# Altium project ElectronicsBox_v2.PrjPcb
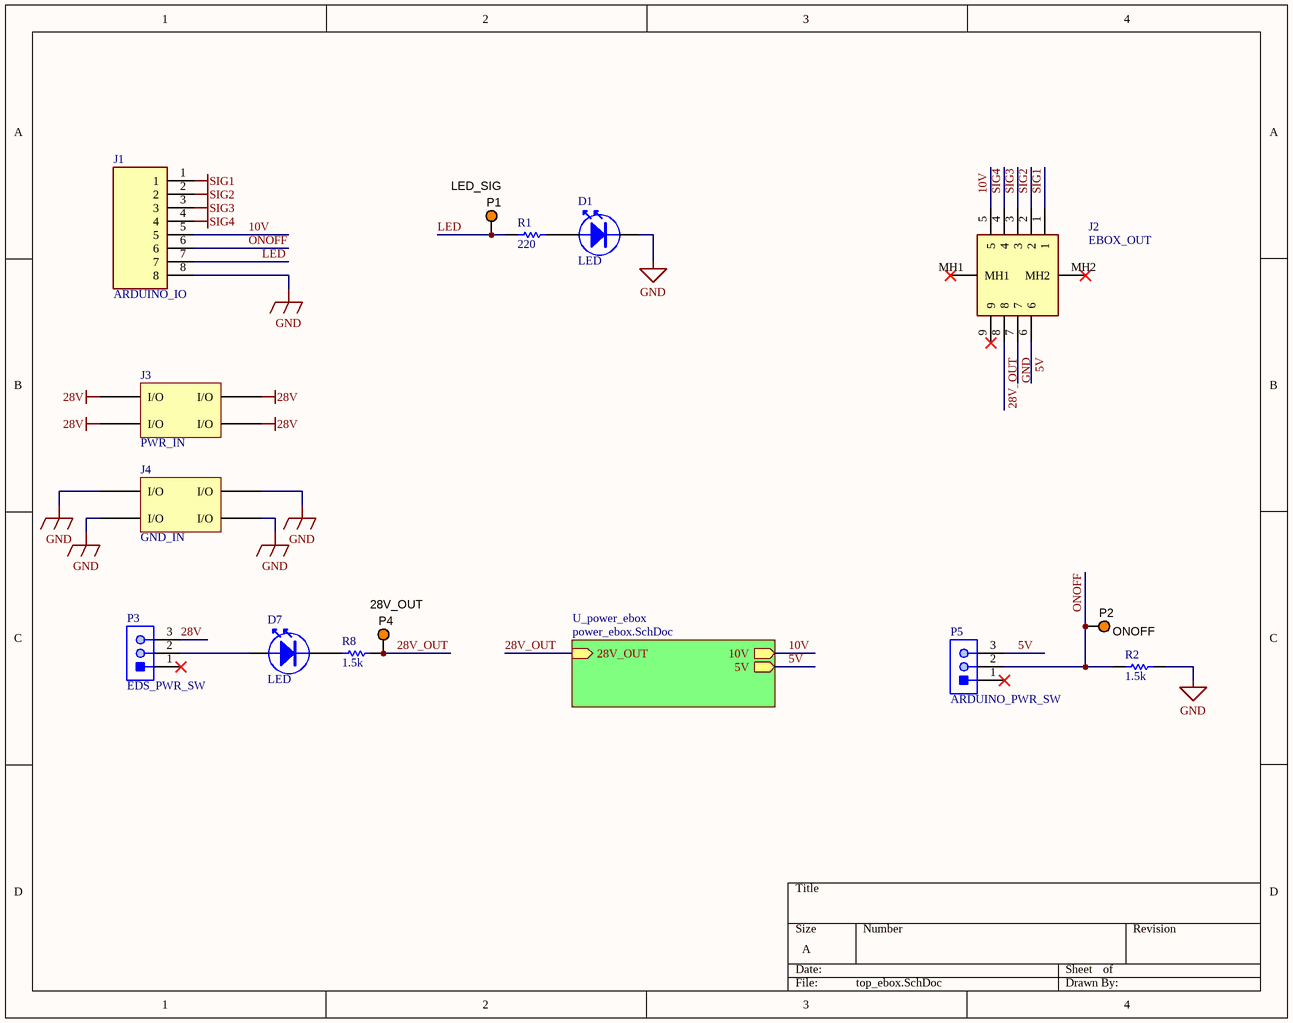
[diagram p0: top_ebox.SchDoc]
2 sheets, 35 parts. Net scope: hierarchical (ports join the sheet entries above them; power ports are global).
Board file: ebox_board.PcbDoc
Sheets:
  top_ebox.SchDoc
    U_power_ebox = power_ebox.SchDoc

## Sheet top_ebox.SchDoc
size A; SheetNumber: 1; SheetTotal: 2

### Parts
D1  LED  [LED 5V Arduino Thru Hole]
D7  LED  [LED 12V Thru Hole]
J1  ARDUINO_IO  [1x8 Molex Header - Female]
J2  EBOX_OUT  [9-Pin D-Sub]
J3  PWR_IN  [Banana Jack]
J4  GND_IN  [Banana Jack]
P1  LED_SIG  [KSTN-5003]
P2  ONOFF  [KSTN-5003]
P3  EDS_PWR_SW  [3x1 KK Molex]
P4  28V_OUT  [KSTN-5003]
P5  ARDUINO_PWR_SW  [3x1 KK Molex]
R1  220  [General Resistor]
R2  1.5k  [General Resistor]
R8  1.5k  [General Resistor]

### Sub-sheets
U_power_ebox = power_ebox.SchDoc: 10V (out), 5V (out), 28V_OUT (in)

### Nets
28V: J3.1(I/O) J3.2(I/O) J3.3(I/O) J3.4(I/O) P3.3
GND: D1.2 J1.8 J2.7 J4.1(I/O) J4.2(I/O) J4.3(I/O) J4.4(I/O) R2.1
SIG1: J1.1 J2.1
SIG2: J1.2 J2.2
SIG3: J1.3 J2.3
SIG4: J1.4 J2.4
5V: J2.6 P5.3 ; sheet U_power_ebox/5V
10V: J1.5 J2.5 ; sheet U_power_ebox/10V
28V_OUT: J2.8 P4.1 R8.1 ; sheet U_power_ebox/28V_OUT
LED: J1.7 P1.1 R1.2
ONOFF: J1.6 P2.1 P5.2 R2.2
NetD1_1: D1.1 R1.1
NetD7_1: D7.1 P3.2
NetD7_2: D7.2 R8.2

Not connected (* = marked no-connect by the designer): J2 9* MH1* MH2*; P3 1*; P5 1*

### Library data of the parts
J1 = 207843-0008: KK Molex 1x8 Header; Datasheet Link: https://www.molex.com/pdm_docs/sd/2078430008_sd.pdf; Height: 6.95mm; Manufacturer_Name: Molex; Manufacturer_Part_Number: 207843-0008; Mouser Part Number: 538-207843-0008; Mouser Price/Stock: https://www.mouser.co.uk/ProductDetail/Molex/207843-0008?qs=XeJtXLiO41QJV3n1oae5pg%3D%3D
J2 = 2311765-1: Connector; Manufacturer_Name: TE Connectivity; Datasheet Link: https://componentsearchengine.com//2311765-1.pdf; Height: 12.8mm; Mouser2 Part Number: 571-2311765-1; Mouser2 Price/Stock: https://www.mouser.com/Search/Refine.aspx?Keyword=571-2311765-1; Manufacturer_Part_Number: 2311765-1
J3 J4 = Banana Jack: Female
P1 P2 P4 = CMP-002-00037-2: Test Point, Orange, Height 4.6 mm, Tail Length 3 mm, 1-Pin THD, RoHS; Manufacturer: Keystone; Colour: Orange; Packaging: Bulk; Package Description: 1-Pin Through Hole Device, Dia 2.54 mm; Pins: 1; Package Reference: 5003; Datasheet Version: Jun-15; Case/Package: 5003; Mounting Technology: TH; Connector Type: TestPoint; Diameter: 2.54mm; Contact Material: Bronze; Datasheet URL: http://keyelco.com/userAssets/file/M65p56.pdf; Manufacturer URL: http://www.keyelco.com/; Package Quantity: 10; Contact Plating: Tin; RoHS Compliant: True
P3 P5 = KK 254 1x3 male header: 22112032
R1 R2 R8 = Resistor

## Sheet power_ebox.SchDoc
size A; SheetNumber: 2; SheetTotal: 2
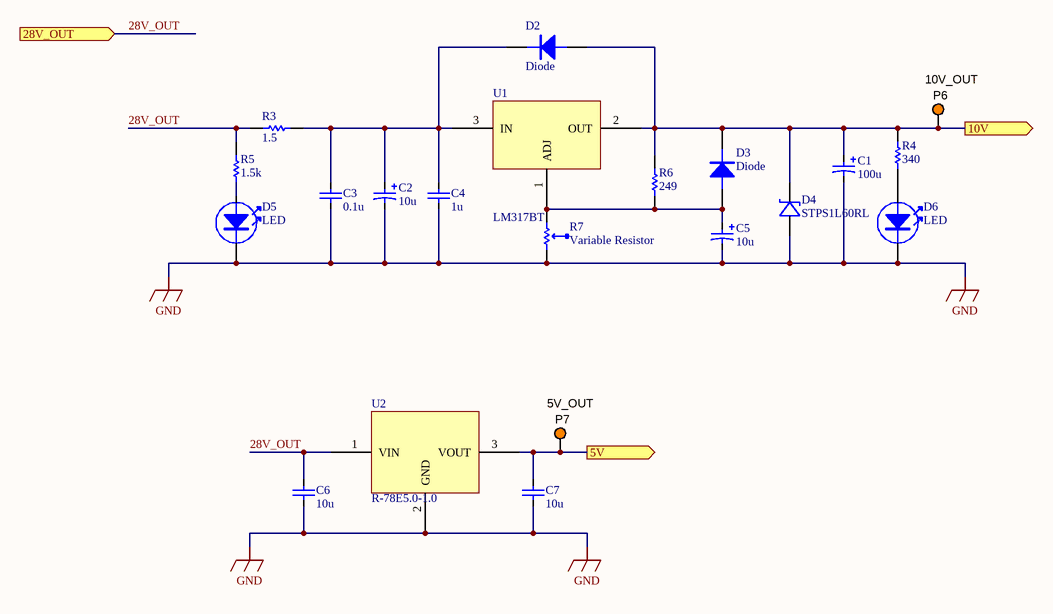
[diagram p1: power_ebox.SchDoc]

### Parts
C1  100u  [100uF Tantalum]
C2  10u  [10uF Tantalum]
C3  0.1u  [0.1uF Cer SMD]
C4  1u  [1uF]
C5  10u  [10uF Electrolytic]
C6  10u  [10uF Cer SMD]
C7  10u  [10uF Cer SMD]
D2  Diode  [Protective Diode]
D3  Diode  [Protective Diode]
D4  STPS1L60RL  [Schottky]
D5  LED  [LED 12V Thru Hole]
D6  LED  [LED 5V Thru Hole]
P6  10V_OUT  [KSTN-5003]
P7  5V_OUT  [KSTN-5003]
R3  1.5  [1.5 Ohm]
R4  340  [340 Ohm]
R5  1.5k  [General Resistor]
R6  249  [249 Ohm]
R7  Variable Resistor  [General Resistor]
U1  LM317BT  [LM317(B)T]
U2  R-78E5.0-1.0  [Step-Down Converter]

### Ports
5V (out), 10V (out), 28V_OUT (in)

### Nets
GND: C1.2 C2.2 C3.1 C4.1 C5.2 C6.1 C7.1 D4.1 D5.2 D6.2 R7.2 U2.2(GND)
5V: C7.2 P7.1 U2.3(VOUT) ; port 5V
10V: C1.1 D2.1 D3.2 D4.2 P6.1 R4.1 R6.1 U1.2(OUT) ; port 10V
28V_OUT: C6.2 R3.2 R5.1 U2.1(VIN) ; port 28V_OUT
NetC2_1: C2.1 C3.2 C4.2 D2.2 R3.1 U1.3(IN)
NetC5_1: C5.1 D3.1 R6.2 R7.1 U1.1(ADJ)
NetD5_1: D5.1 R5.2
NetD6_1: D6.1 R4.2

### Library data of the parts
C1 C2 = Capacitor - Polarized
C3 C4 C6 C7 = Capacitor - Ceramic
C5 = Capacitor - Polarized: Electrolytic
D4 = Schottky: Mfr_Name: STMicroelectronics; Type: DEV; Copyright: Copyright (C) 2021 Ultra Librarian. All rights reserved.; Manufacturer_Part_Number: STPS1L60RL; Digi-Key_Part_Number_1: 497-16205-2-ND; Digi-Key_Part_Number_2: 497-16205-1-ND; RefDes: RefDes
P6 P7 = CMP-002-00037-2: as P1 on sheet top_ebox; Colour: Orange; Packaging: Bulk; Package Description: 1-Pin Through Hole Device, Dia 2.54 mm; Pins: 1; Package Reference: 5003; Datasheet Version: Jun-15; Case/Package: 5003; Mounting Technology: TH; Connector Type: TestPoint; Diameter: 2.54mm; Contact Material: Bronze; Datasheet URL: http://keyelco.com/userAssets/file/M65p56.pdf; Manufacturer URL: http://www.keyelco.com/; Package Quantity: 10; Contact Plating: Tin; RoHS Compliant: True
R3-R6 = Resistor
U1 = Linear Regulator
U2 = Step-down Converter

## Nets that join several sheets
GND: top_ebox (8 pins), power_ebox (12 pins)
5V: top_ebox (J2.6 P5.3), power_ebox (C7.2 P7.1 U2.3)
10V: top_ebox (J1.5 J2.5), power_ebox (8 pins)
28V_OUT: top_ebox (J2.8 P4.1 R8.1), power_ebox (C6.2 R3.2 R5.1 U2.1)